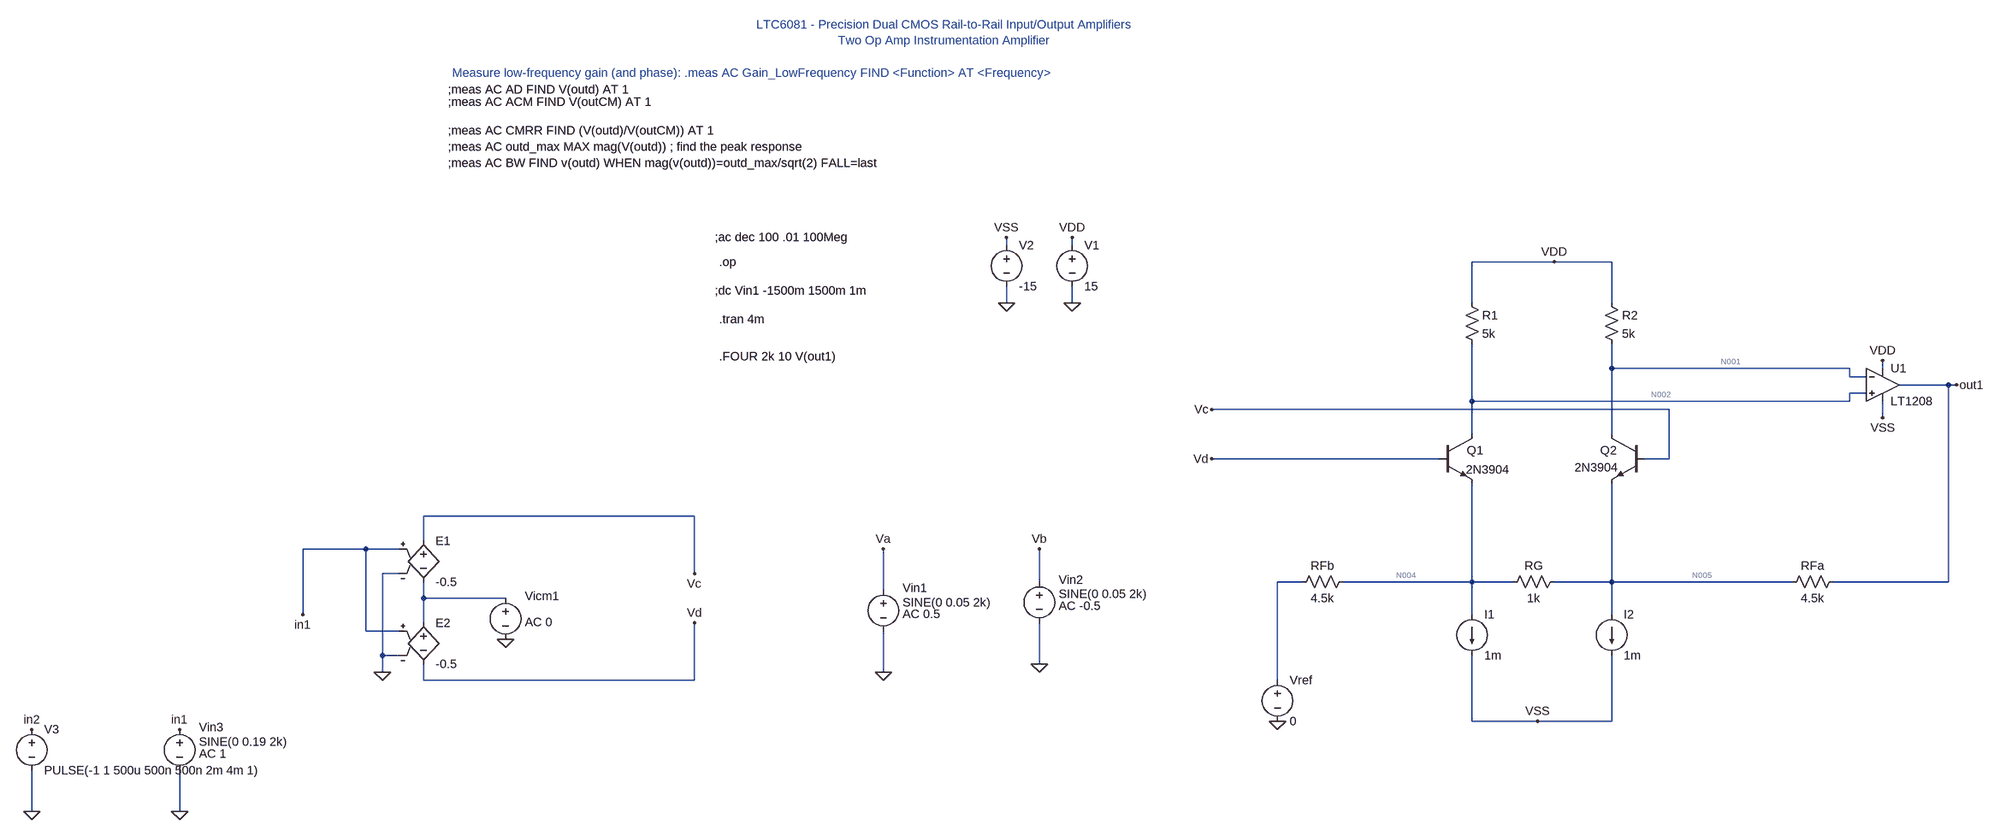
[diagram p0: schematic Etaj 1.asc]
Etaj 1.asc, the LTspice schematic file:
Version 4
SHEET 1 3624 1836
WIRE -3136 -272 -3136 -288
WIRE -3008 -272 -3008 -288
WIRE -2064 -240 -2224 -240
WIRE -1952 -240 -2064 -240
WIRE -3136 -160 -3136 -192
WIRE -3008 -160 -3008 -192
WIRE -2224 -160 -2224 -240
WIRE -1952 -160 -1952 -240
WIRE -1952 -32 -1952 -80
WIRE -1488 -32 -1952 -32
WIRE -1424 -32 -1424 -48
WIRE -1488 -16 -1488 -32
WIRE -1456 -16 -1488 -16
WIRE -1296 0 -1392 0
WIRE -1280 0 -1296 0
WIRE -1456 16 -1488 16
WIRE -2224 32 -2224 -80
WIRE -1488 32 -1488 16
WIRE -1488 32 -2224 32
WIRE -1840 48 -2736 48
WIRE -1424 64 -1424 32
WIRE -2224 96 -2224 32
WIRE -1952 96 -1952 -32
WIRE -2288 144 -2736 144
WIRE -1840 144 -1840 48
WIRE -1840 144 -1888 144
WIRE -3744 256 -4272 256
WIRE -4272 304 -4272 256
WIRE -4384 320 -4512 320
WIRE -4320 320 -4384 320
WIRE -4320 368 -4352 368
WIRE -3744 368 -3744 256
WIRE -3072 384 -3072 320
WIRE -2560 384 -2608 384
WIRE -2224 384 -2224 192
WIRE -2224 384 -2480 384
WIRE -2144 384 -2224 384
WIRE -1952 384 -1952 192
WIRE -1952 384 -2064 384
WIRE -1600 384 -1952 384
WIRE -1296 384 -1296 0
WIRE -1296 384 -1520 384
WIRE -3376 400 -3376 320
WIRE -4272 416 -4272 384
WIRE -4112 416 -4272 416
WIRE -4512 448 -4512 320
WIRE -2224 448 -2224 384
WIRE -1952 448 -1952 384
WIRE -4272 464 -4272 416
WIRE -4384 480 -4384 320
WIRE -4320 480 -4384 480
WIRE -4352 528 -4352 368
WIRE -4320 528 -4352 528
WIRE -3072 544 -3072 464
WIRE -4352 560 -4352 528
WIRE -3376 560 -3376 480
WIRE -4272 576 -4272 544
WIRE -3744 576 -3744 464
WIRE -3744 576 -4272 576
WIRE -2608 576 -2608 384
WIRE -2224 656 -2224 528
WIRE -2096 656 -2224 656
WIRE -1952 656 -1952 528
WIRE -1952 656 -2096 656
WIRE -5040 832 -5040 752
WIRE -4752 832 -4752 752
FLAG -3008 -160 0
FLAG -3008 -288 VDD
FLAG -3136 -160 0
FLAG -3136 -288 VSS
FLAG -1424 -48 VDD
FLAG -1424 64 VSS
FLAG -1280 0 out1
FLAG -2064 -240 VDD
FLAG -2096 656 VSS
FLAG -3376 560 0
FLAG -3072 544 0
FLAG -2608 656 0
FLAG -3376 320 Va
FLAG -3072 320 Vb
FLAG -4752 832 0
FLAG -4352 560 0
FLAG -4112 496 0
FLAG -3744 368 Vc
FLAG -3744 464 Vd
FLAG -5040 832 0
FLAG -5040 672 in2
FLAG -4752 672 in1
FLAG -4512 448 in1
FLAG -2736 48 Vc
FLAG -2736 144 Vd
DATAFLAG -2224 -32 ""
DATAFLAG -1952 -48 ""
DATAFLAG -2224 336 ""
DATAFLAG -1952 304 ""
SYMBOL voltage -3008 -288 R0
WINDOW 123 0 0 Left 2
WINDOW 39 0 0 Left 2
SYMATTR InstName V1
SYMATTR Value 15
SYMBOL voltage -3136 -288 R0
WINDOW 123 0 0 Left 2
WINDOW 39 0 0 Left 2
SYMATTR InstName V2
SYMATTR Value -15
SYMBOL npn -2288 96 R0
WINDOW 0 54 32 Left 2
WINDOW 3 52 69 Left 2
SYMATTR InstName Q1
SYMATTR Value 2N3904
SYMBOL npn -1888 96 M0
WINDOW 0 54 32 Left 2
WINDOW 3 51 65 Left 2
SYMATTR InstName Q2
SYMATTR Value 2N3904
SYMBOL res -2240 -176 R0
SYMATTR InstName R1
SYMATTR Value 5k
SYMBOL res -1968 -176 R0
SYMATTR InstName R2
SYMATTR Value 5k
SYMBOL res -1504 368 R90
WINDOW 0 0 56 VBottom 2
WINDOW 3 32 56 VTop 2
SYMATTR InstName RFa
SYMATTR Value 4.5k
SYMBOL res -2048 368 R90
WINDOW 0 0 56 VBottom 2
WINDOW 3 32 56 VTop 2
SYMATTR InstName RG
SYMATTR Value 1k
SYMBOL res -2464 368 R90
WINDOW 0 0 56 VBottom 2
WINDOW 3 32 56 VTop 2
SYMATTR InstName RFb
SYMATTR Value 4.5k
SYMBOL current -2224 448 R0
WINDOW 123 0 0 Left 0
WINDOW 39 0 0 Left 0
SYMATTR InstName I1
SYMATTR Value 1m
SYMBOL current -1952 448 R0
WINDOW 123 0 0 Left 0
WINDOW 39 0 0 Left 0
SYMATTR InstName I2
SYMATTR Value 1m
SYMBOL voltage -3376 384 R0
WINDOW 123 38 63 Left 2
WINDOW 39 0 0 Left 2
WINDOW 0 38 12 Left 2
WINDOW 3 38 40 Left 2
SYMATTR Value2 AC 0.5
SYMATTR InstName Vin1
SYMATTR Value SINE(0 0.05 2k)
SYMBOL OpAmps\\LT1208 -1424 -64 R0
SYMATTR InstName U1
SYMBOL voltage -3072 368 R0
WINDOW 123 38 63 Left 2
WINDOW 39 0 0 Left 2
WINDOW 0 38 12 Left 2
WINDOW 3 38 40 Left 2
SYMATTR Value2 AC -0.5
SYMATTR InstName Vin2
SYMATTR Value SINE(0 0.05 2k)
SYMBOL voltage -2608 560 R0
WINDOW 123 0 0 Left 0
WINDOW 39 0 0 Left 0
SYMATTR InstName Vref
SYMATTR Value 0
SYMBOL voltage -4752 656 R0
WINDOW 123 38 63 Left 2
WINDOW 39 0 0 Left 2
WINDOW 0 38 12 Left 2
WINDOW 3 38 40 Left 2
SYMATTR Value2 AC 1
SYMATTR InstName Vin3
SYMATTR Value SINE(0 0.19 2k)
SYMBOL e -4272 288 R0
SYMATTR InstName E1
SYMATTR Value -0.5
SYMBOL e -4272 448 R0
SYMATTR InstName E2
SYMATTR Value -0.5
SYMBOL voltage -4112 400 R0
WINDOW 123 38 63 Left 2
WINDOW 39 0 0 Left 2
WINDOW 0 38 12 Left 2
WINDOW 3 -188 38 Left 2
SYMATTR Value2 AC 0
SYMATTR InstName Vicm1
SYMATTR Value ""
SYMBOL voltage -5040 656 R0
WINDOW 123 24 124 Left 2
WINDOW 39 0 0 Left 0
SYMATTR InstName V3
SYMATTR Value PULSE(-1 1 500u 500n 500n 2m 4m 1)
TEXT -3704 -288 Left 2 !;ac dec 100 .01 100Meg
TEXT -4224 -1200 Left 2 !;meas AC AD FIND V(outd) AT 1
TEXT -4216 -1232 Left 2 ;Measure low-frequency gain (and phase): .meas AC Gain_LowFrequency FIND <Function> AT <Frequency>
TEXT -4224 -1176 Left 2 !;meas AC ACM FIND V(outCM) AT 1
TEXT -4224 -1120 Left 2 !;meas AC CMRR FIND (V(outd)/V(outCM)) AT 1
TEXT -3256 -1280 Bottom 2 ;LTC6081 - Precision Dual CMOS Rail-to-Rail Input/Output Amplifiers\nTwo Op Amp Instrumentation Amplifier
TEXT -4224 -1088 Left 2 !;meas AC outd_max MAX mag(V(outd)) ; find the peak response\n;meas AC BW FIND v(outd) WHEN mag(v(outd))=outd_max/sqrt(2) FALL=last
TEXT -3696 -240 Left 2 !.op
TEXT -3704 -184 Left 2 !;dc Vin1 -1500m 1500m 1m
TEXT -3696 -128 Left 2 !.tran 4m
TEXT -3696 -56 Left 2 !.FOUR 2k 10 V(out1)

The netlist it stands for:
* Etaj 1.asc
V1 VDD 0 15
V2 VSS 0 -15
Q1 N002 Vd N004 0 2N3904
Q2 N001 Vc N005 0 2N3904
R1 VDD N002 5k
R2 VDD N001 5k
RFa out1 N005 4.5k
RG N005 N004 1k
RFb N004 N003 4.5k
I1 N004 VSS 1m
I2 N005 VSS 1m
Vin1 Va 0 SINE(0 0.05 2k) AC 0.5
XU1 N002 N001 VDD VSS out1 LT1208  ; pins In+ In- V+ V- OUT
Vin2 Vb 0 SINE(0 0.05 2k) AC -0.5
Vref N003 0 0
Vin3 in1 0 SINE(0 0.19 2k) AC 1
E1 Vc N006 in1 0 -0.5
E2 N006 Vd in1 0 -0.5
Vicm1 N006 0 AC 0
V3 in2 0 PULSE(-1 1 500u 500n 500n 2m 4m 1)
.model NPN NPN
.model PNP PNP
.lib standard.bjt
;ac dec 100 .01 100Meg
;meas AC AD FIND V(outd) AT 1
* Measure low-frequency gain (and phase): .meas AC Gain_LowFrequency FIND <Function> AT <Frequency>
;meas AC ACM FIND V(outCM) AT 1
;meas AC CMRR FIND (V(outd)/V(outCM)) AT 1
* LTC6081 - Precision Dual CMOS Rail-to-Rail Input/Output Amplifiers
* Two Op Amp Instrumentation Amplifier
;meas AC outd_max MAX mag(V(outd)) ; find the peak response
;meas AC BW FIND v(outd) WHEN mag(v(outd))=outd_max/sqrt(2) FALL=last
.op
;dc Vin1 -1500m 1500m 1m
.tran 4m
.FOUR 2k 10 V(out1)
.backanno
.end

* Results of the author's LTspice run, read from the files saved beside the schematic
* Operating Point, zero values left out:
*   V(vdd) = 15 V
*   V(vss) = -15 V
*   V(n002) = 10.71 V
*   V(n004) = -648.6 mV
*   V(n001) = 10.71 V
*   V(n005) = -648.6 mV
*   V(out1) = -1.125 µV
*   V(in2) = -1 V
*   Ic(Q1) = 853.3 µA
*   Ib(Q1) = 2.574 µA
*   Ie(Q1) = -855.9 µA
*   Ic(Q2) = 853.3 µA
*   Ib(Q2) = 2.574 µA
*   Ie(Q2) = -855.9 µA
*   I(I1) = 1 mA
*   I(I2) = 1 mA
*   I(R1) = 857.6 µA
*   I(R2) = 857.6 µA
*   I(Rfa) = 144.1 µA
*   I(Rg) = -7.373 pA
*   I(Rfb) = -144.1 µA
*   I(E1) = -2.574 µA
*   I(E2) = 2.574 µA
*   I(V1) = -8.786 mA
*   I(V2) = 8.935 mA
*   I(Vref) = -144.1 µA
*   I(Vicm1) = -5.148 µA
*   Ix(u1:1) = 4.268 µA
*   Ix(u1:2) = 4.268 µA
*   Ix(u1:3) = 7.071 mA
*   Ix(u1:4) = -6.935 mA
*   Ix(u1:5) = -144.1 µA
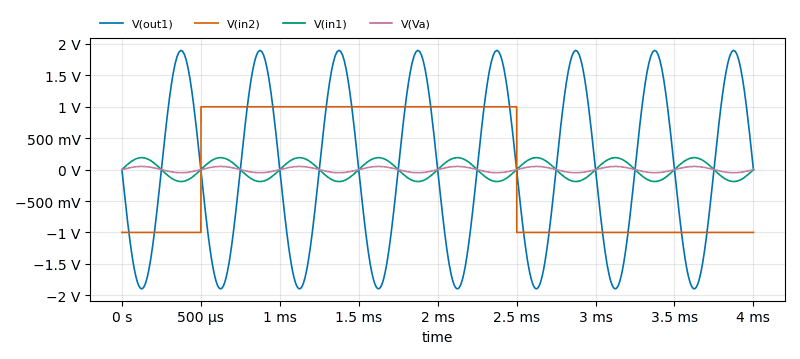
[diagram p1: Transient Analysis of Etaj 1.asc, plotted from the saved traces]
* Transient Analysis, 1 run:
*   V(out1): min -1.898 V, max 1.898 V, average -643 µV, rms 1.342 V, last 124.1 µV
*   V(in2): min -1 V, max 1 V, average 250 µV, rms 999.9 mV, last -1 V
*   V(in1): min -190 mV, max 190 mV, average 64.49 µV, rms 134.3 mV, last 0 V
*   V(Va): min -50 mV, max 49.99 mV, average 16.97 µV, rms 35.35 mV, last 0 V
* From the log:
*   N-Period=1
*   Fourier components of V(out1)
*   DC component:-0.000652426
*   Harmonic  Frequency   Fourier   Normalized   Phase    Normalized
*    Number     [Hz]     Component   Component  [degree]  Phase [deg]
*       1      2.000e+3   1.896e+0   1.000e+0    -90.00°      0.00°
*       2      4.000e+3   4.027e-4   2.124e-4      0.62°     90.61°
*       3      6.000e+3   2.305e-4   1.216e-4    -90.87°     -0.87°
*       4      8.000e+3   2.261e-4   1.192e-4     -2.54°     87.46°
*       5      1.000e+4   1.211e-4   6.390e-5    -95.49°     -5.50°
*       6      1.200e+4   1.569e-4   8.274e-5     -6.88°     83.12°
*       7      1.400e+4   1.099e-5   5.797e-6     96.97°    186.97°
*       8      1.600e+4   9.460e-6   4.990e-6    179.99°    269.99°
*       9      1.800e+4   1.387e-5   7.316e-6     97.78°    187.78°
*      10      2.000e+4   9.223e-5   4.865e-5    167.87°    257.86°
*   Partial Harmonic Distortion: 0.029584%
*   Total Harmonic Distortion:   0.068325%